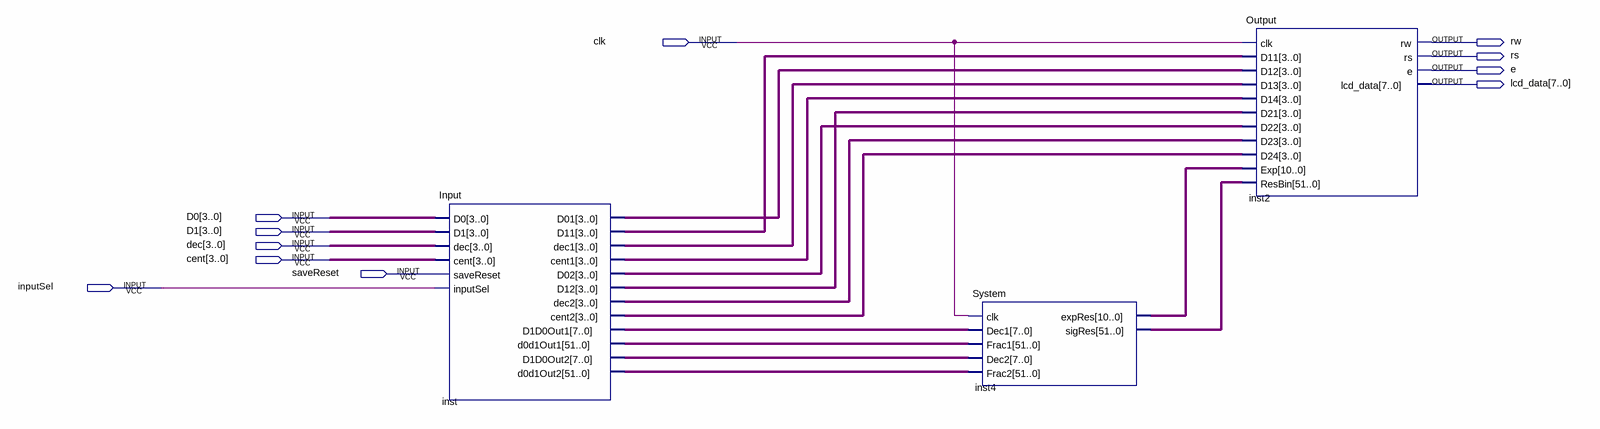
[diagram p0: schematic sheet]
// Quartus schematic Full_System.bdf as structural Verilog: 3 symbols, 11 pins
module Full_System (
  input  clk,
  input  [3:0] D0,
  input  [3:0] D1,
  input  [3:0] dec,
  input  [3:0] cent,
  input  saveReset,
  input  inputSel,
  output rw,
  output rs,
  output e,
  output [7:0] lcd_data
);

  wire [3:0] inst_cent1, inst_cent2, inst_d01, inst_d02, inst_d11, inst_d12, inst_dec1, inst_dec2;
  wire [7:0] inst_d1d0out1, inst_d1d0out2;
  wire [10:0] inst4_expres;
  wire [51:0] inst4_sigres, inst_d0d1out1, inst_d0d1out2;

  Input inst (
    .D0(D0), .D1(D1), .dec(dec), .cent(cent), .saveReset(saveReset), .inputSel(inputSel), .D01(inst_d01),
    .D11(inst_d11), .dec1(inst_dec1), .cent1(inst_cent1), .D02(inst_d02), .D12(inst_d12), .dec2(inst_dec2),
    .cent2(inst_cent2), .D1D0Out1(inst_d1d0out1), .d0d1Out1(inst_d0d1out1), .D1D0Out2(inst_d1d0out2),
    .d0d1Out2(inst_d0d1out2));
  System inst4 (
    .clk(clk), .Dec1(inst_d1d0out1), .Frac1(inst_d0d1out1), .Dec2(inst_d1d0out2), .Frac2(inst_d0d1out2),
    .expRes(inst4_expres), .sigRes(inst4_sigres));
  Output inst2 (
    .clk(clk), .D11(inst_d11), .D12(inst_d01), .D13(inst_dec1), .D14(inst_cent1), .D21(inst_d12),
    .D22(inst_d02), .D23(inst_dec2), .D24(inst_cent2), .Exp(inst4_expres), .ResBin(inst4_sigres), .rw(rw),
    .rs(rs), .e(e), .lcd_data(lcd_data));
endmodule
